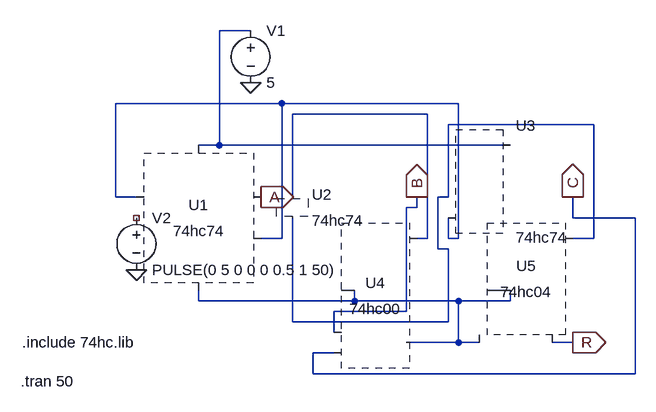
[diagram p0: schematic qn5.asc]
qn5.asc, the LTspice schematic file:
Version 4
SHEET 1 880 680
WIRE 192 -112 144 -112
WIRE 240 0 -16 0
WIRE 512 0 240 0
WIRE 464 16 256 16
WIRE 720 32 496 32
WIRE 144 64 144 -112
WIRE 144 64 112 64
WIRE 352 64 144 64
WIRE 592 64 352 64
WIRE -16 144 -16 0
WIRE 16 144 -16 144
WIRE 256 144 256 16
WIRE 496 144 496 32
WIRE 496 144 480 144
WIRE 448 160 448 144
WIRE 448 160 432 160
WIRE 688 176 688 144
WIRE 784 176 688 176
WIRE 240 208 240 0
WIRE 240 208 208 208
WIRE 464 208 464 16
WIRE 464 208 448 208
WIRE 496 208 496 176
WIRE 512 208 512 0
WIRE 512 208 496 208
WIRE 720 208 720 32
WIRE 720 208 688 208
WIRE 480 224 480 144
WIRE 496 224 480 224
WIRE 112 304 112 288
WIRE 352 304 352 288
WIRE 352 304 112 304
WIRE 512 304 352 304
WIRE 592 304 592 288
WIRE 592 304 512 304
WIRE 432 320 432 160
WIRE 432 320 320 320
WIRE 256 336 256 176
WIRE 496 336 496 224
WIRE 496 336 256 336
WIRE 320 352 320 320
WIRE 512 368 512 304
WIRE 512 368 432 368
WIRE 544 368 512 368
WIRE 688 368 656 368
WIRE 320 384 288 384
WIRE 288 416 288 384
WIRE 784 416 784 176
WIRE 784 416 288 416
FLAG 192 -32 0
FLAG 16 256 0
FLAG 208 144 A
IOPIN 208 144 Out
FLAG 448 144 B
IOPIN 448 144 Out
FLAG 688 144 C
IOPIN 688 144 Out
FLAG 688 368 R
IOPIN 688 368 Out
SYMBOL 74HC\\74hc74 112 64 R0
SYMATTR InstName U1
SYMBOL 74HC\\74hc74 352 64 R0
SYMATTR InstName U2
SYMBOL 74HC\\74hc74 592 64 R0
SYMATTR InstName U3
SYMBOL 74HC\\74hc00 368 304 R0
SYMATTR InstName U4
SYMBOL voltage 192 -128 R0
WINDOW 123 0 0 Left 0
WINDOW 39 0 0 Left 0
SYMATTR InstName V1
SYMATTR Value 5
SYMBOL voltage 16 160 R0
WINDOW 123 0 0 Left 0
WINDOW 39 0 0 Left 0
SYMATTR InstName V2
SYMATTR Value PULSE(0 5 0 0 0 0.5 1 50)
SYMBOL 74HC\\74hc04 592 304 R0
SYMATTR InstName U5
TEXT -160 368 Left 2 !.include 74hc.lib
TEXT -162 428 Left 2 !.tran 50

The netlist it stands for:
* qn5.asc
* U1: 74hc74 (symbol 74HC\74hc74 not available, pin order unknown); nets seen at it: A, N001, N002, N005
* U2: 74hc74 (symbol 74HC\74hc74 not available, pin order unknown); nets seen at it: N003, N004
* U3: 74hc74 (symbol 74HC\74hc74 not available, pin order unknown); nets seen at it: N001, N002
* U4: 74hc00 (symbol 74HC\74hc00 not available, pin order unknown); nets seen at it: B, C, N003, N005
V1 N001 0 5
V2 NC_01 0 PULSE(0 5 0 0 0 0.5 1 50)
* U5: 74hc04 (symbol 74HC\74hc04 not available, pin order unknown); nets seen at it: N004, N005, R
.include 74hc.lib
.tran 50
.backanno
.end